# Altium schematic sheet 2016_BeaconIR_YahourtPhone.SchDoc
size A2
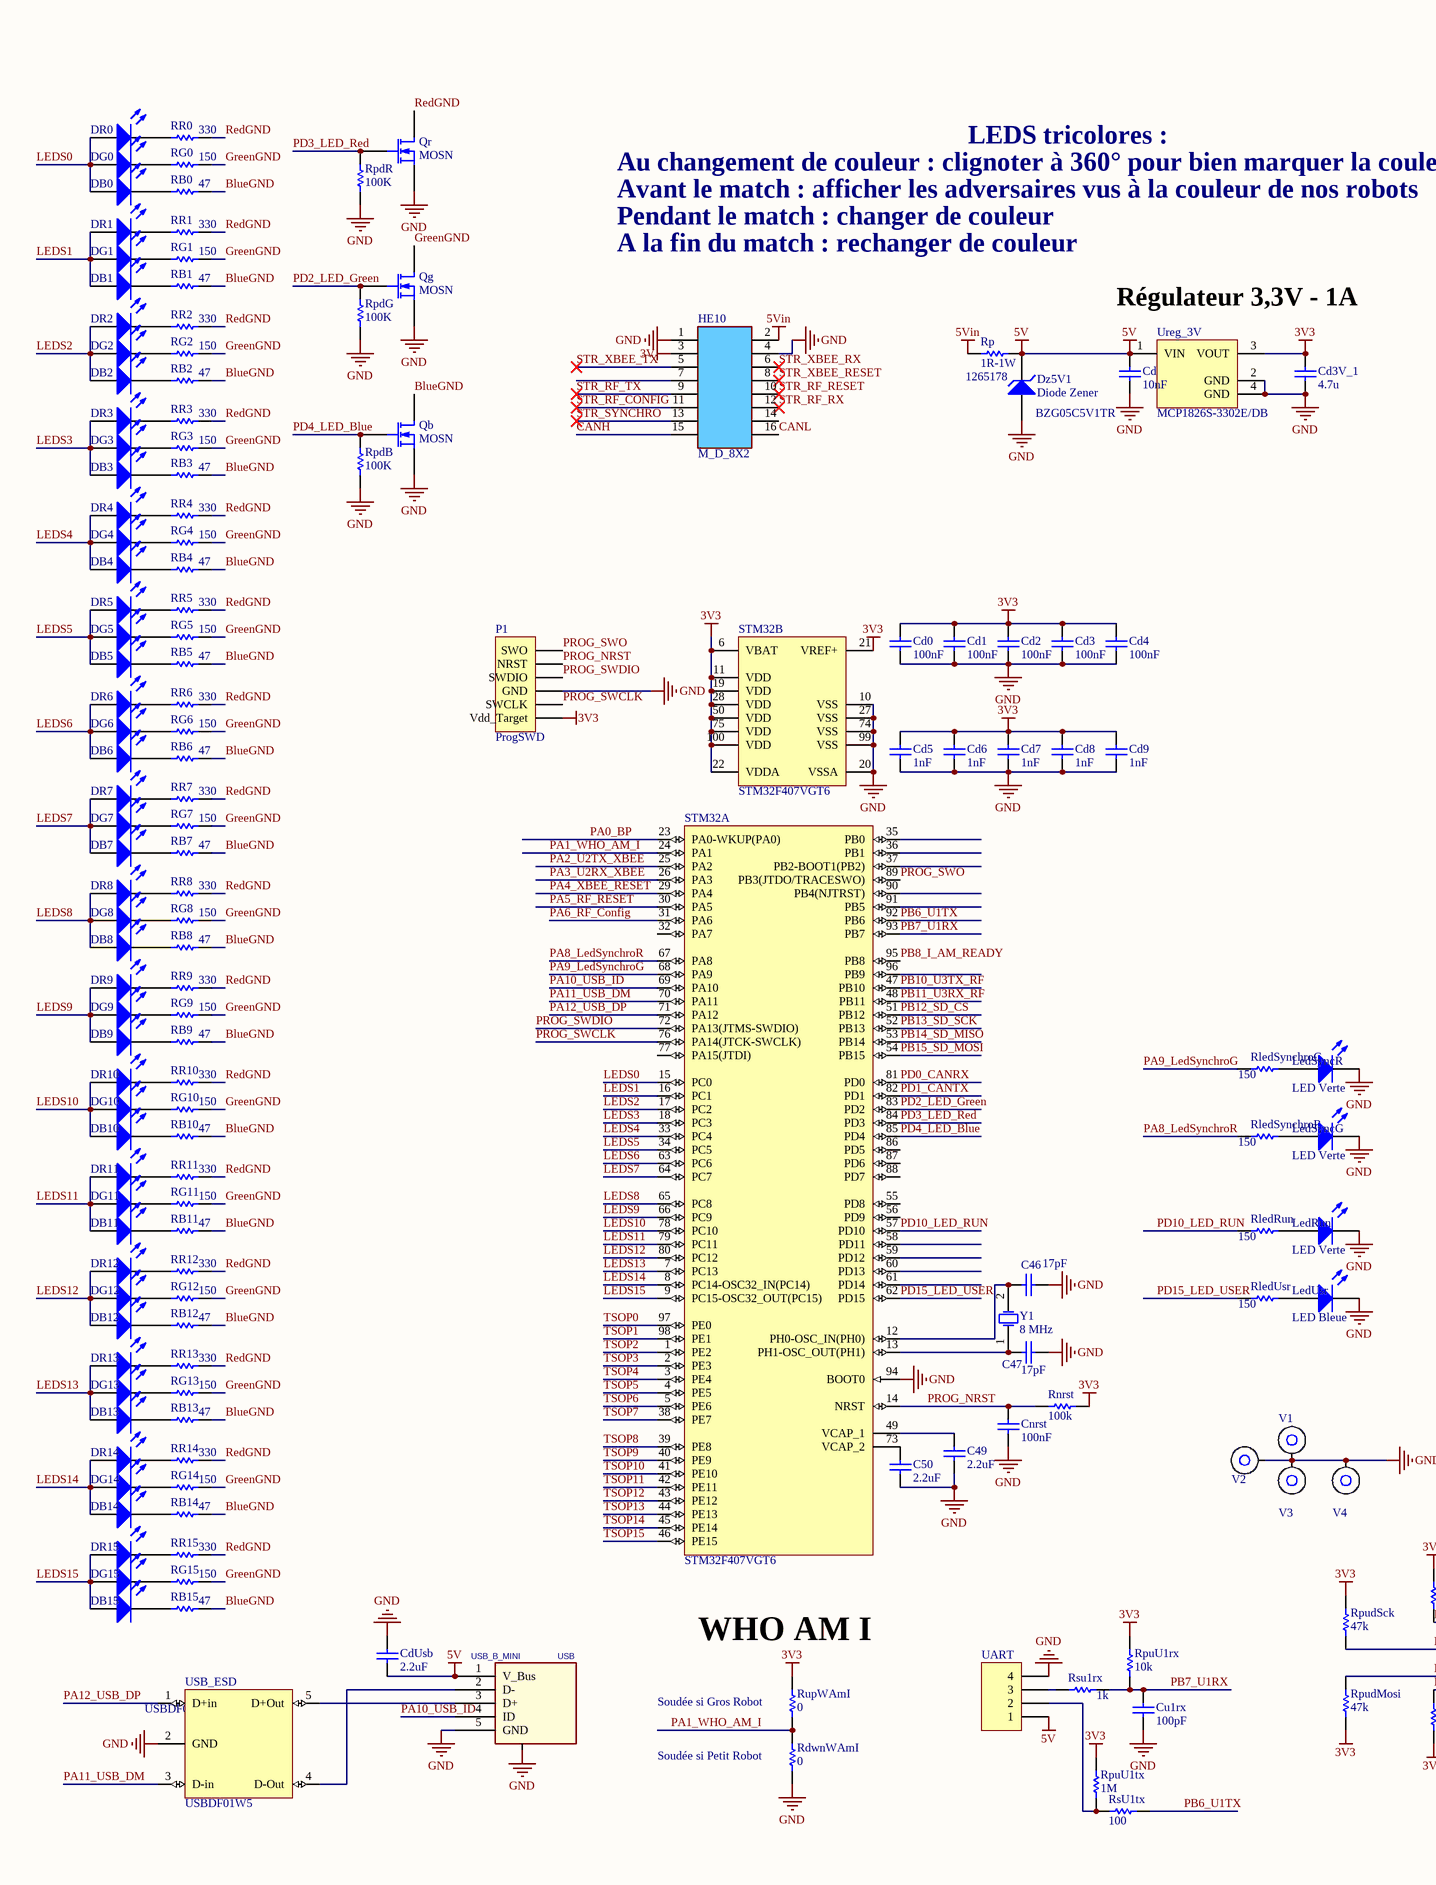
[diagram p0: 2016_BeaconIR_YahourtPhone.SchDoc, left]
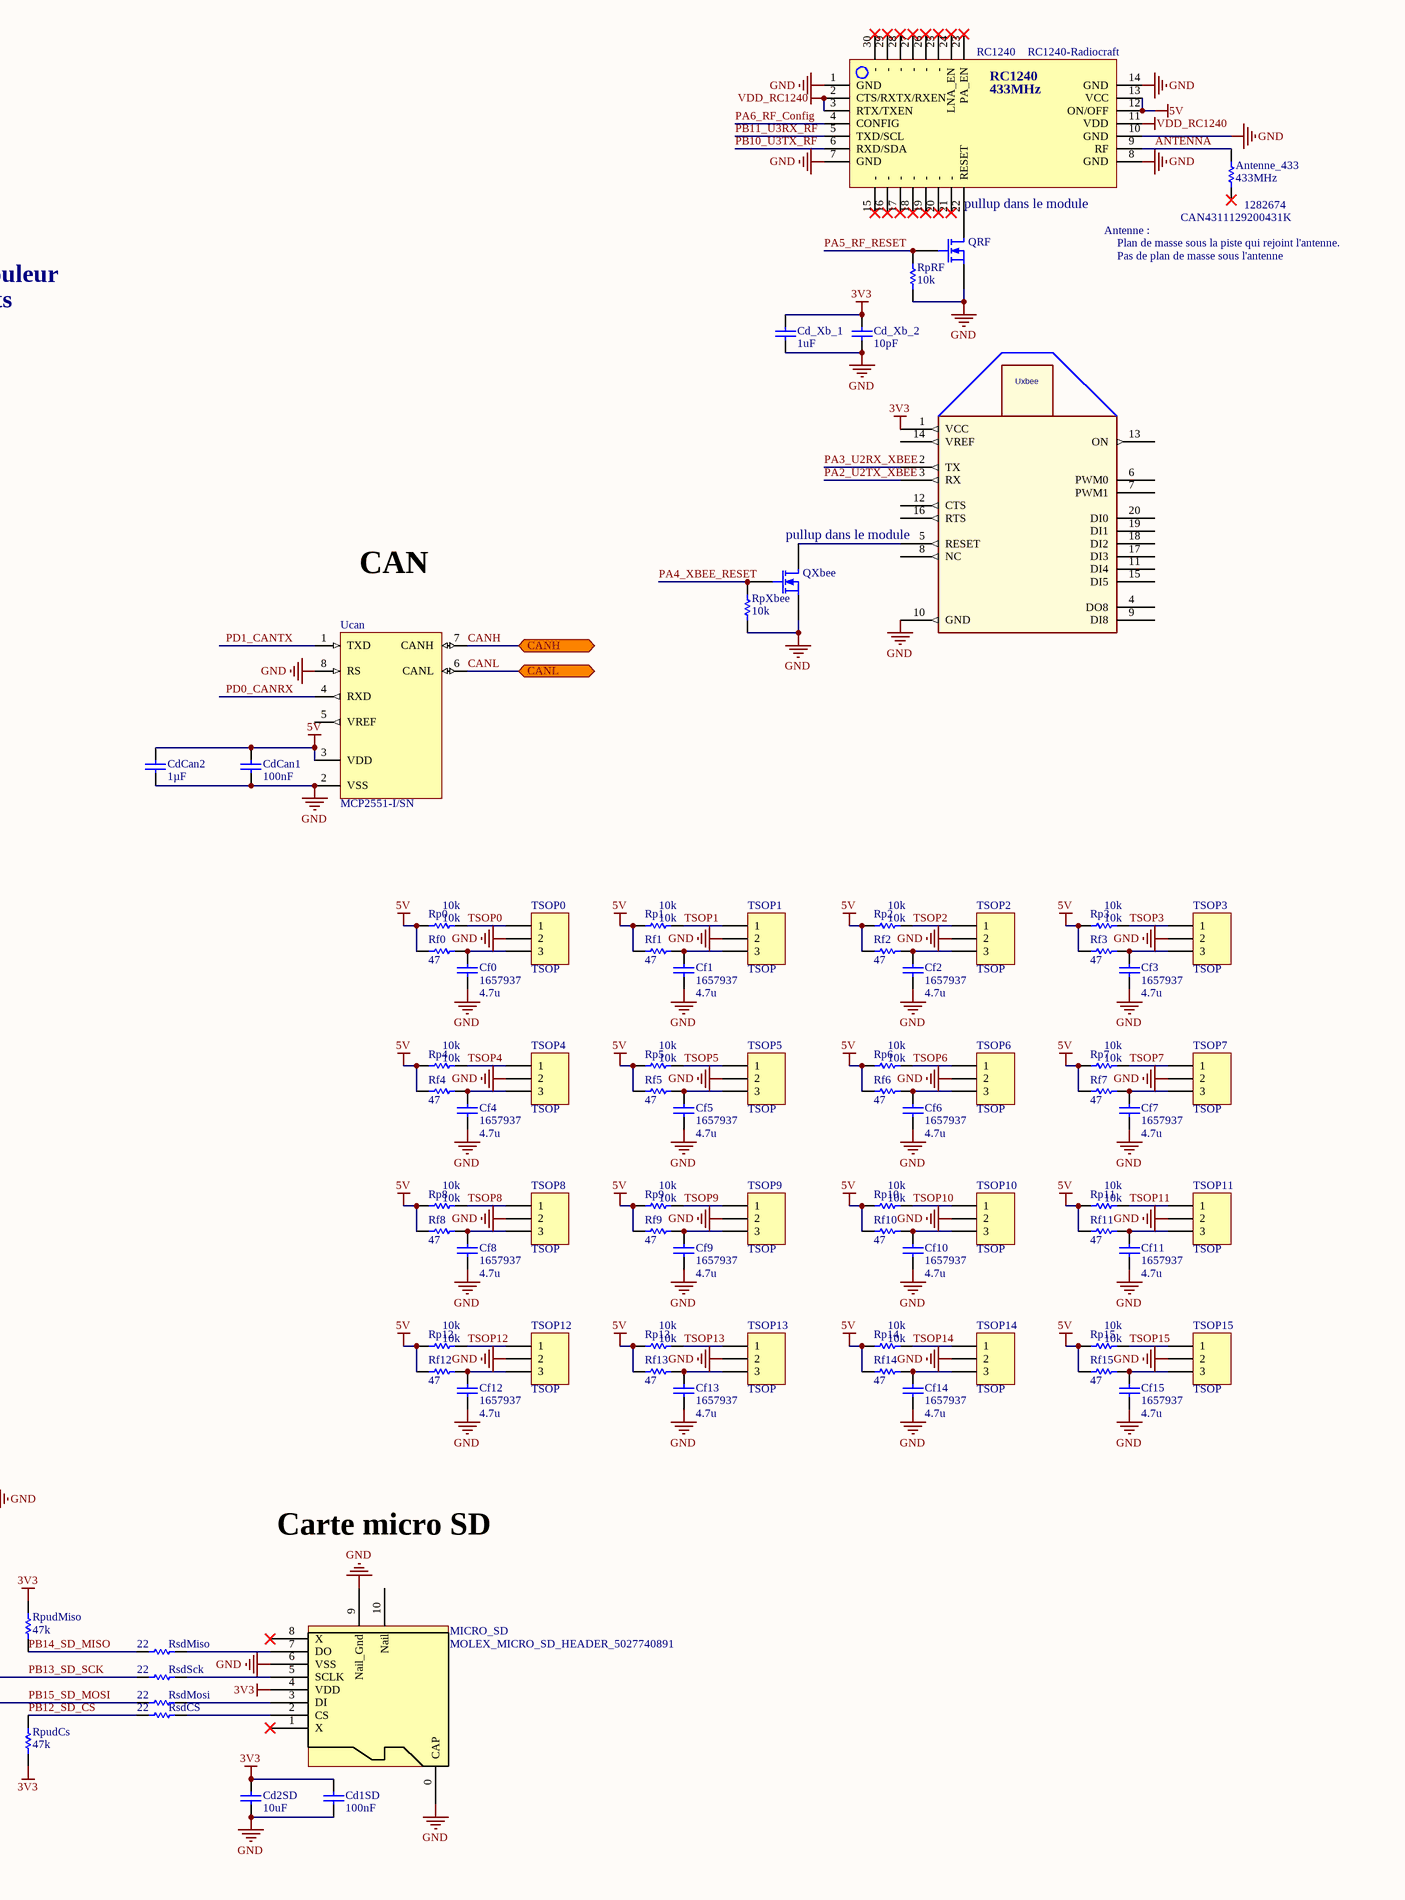
[diagram p1: 2016_BeaconIR_YahourtPhone.SchDoc, middle]
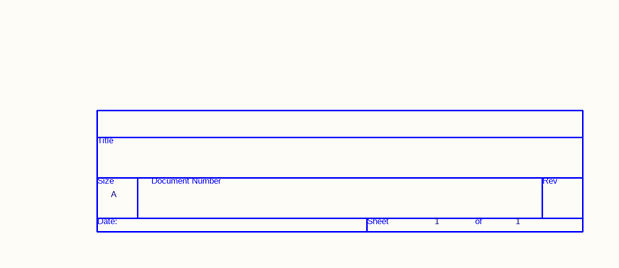
[diagram p2: 2016_BeaconIR_YahourtPhone.SchDoc, right]

## Parts
*  Page Count: 1  Page Size: A  (hidden comment: TitleBlock0)  (graphical)
Antenne_433  433MHz  FAR: 1282674  [R1206_N]
C46  17pF  [C0805_N]
C47  17pF  [C0805_N]
C49  2.2uF  [C0805_N]
C50  2.2uF  [C0805_N]
Cd  10nF  [C1206_N]
Cd0  100nF  [C0805_N]
Cd1  100nF  [C0805_N]
Cd1SD  100nF  [C0805_N]
Cd2  100nF  [C0805_N]
Cd2SD  10uF  [C1206_N]
Cd3  100nF  [C0805_N]
Cd3V_1  4.7u  [C0805_N]
Cd4  100nF  [C0805_N]
Cd5  1nF  [C0805_N]
Cd6  1nF  [C0805_N]
Cd7  1nF  [C0805_N]
Cd8  1nF  [C0805_N]
Cd9  1nF  [C0805_N]
Cd_Xb_1  1uF  [C0805_N]
Cd_Xb_2  10pF  [C0805_N]
CdCan1  100nF  [C0805_N]
CdCan2  1µF  [C0805_N]
CdUsb  2.2uF  [C0805_N]
Cf0  1657937  value 4.7u  [C1206_N]
Cf1  1657937  value 4.7u  [C1206_N]
Cf2  1657937  value 4.7u  [C1206_N]
Cf3  1657937  value 4.7u  [C1206_N]
Cf4  1657937  value 4.7u  [C1206_N]
Cf5  1657937  value 4.7u  [C1206_N]
Cf6  1657937  value 4.7u  [C1206_N]
Cf7  1657937  value 4.7u  [C1206_N]
Cf8  1657937  value 4.7u  [C1206_N]
Cf9  1657937  value 4.7u  [C1206_N]
Cf10  1657937  value 4.7u  [C1206_N]
Cf11  1657937  value 4.7u  [C1206_N]
Cf12  1657937  value 4.7u  [C1206_N]
Cf13  1657937  value 4.7u  [C1206_N]
Cf14  1657937  value 4.7u  [C1206_N]
Cf15  1657937  value 4.7u  [C1206_N]
Cnrst  100nF  [C0805_N]
Cu1rx  100pF  [C0805_N]
DB0  LED  [LED_sideView_1204]  (value not drawn)
DB1  LED  [LED_sideView_1204]  (value not drawn)
DB2  LED  [LED_sideView_1204]  (value not drawn)
DB3  LED  [LED_sideView_1204]  (value not drawn)
DB4  LED  [LED_sideView_1204]  (value not drawn)
DB5  LED  [LED_sideView_1204]  (value not drawn)
DB6  LED  [LED_sideView_1204]  (value not drawn)
DB7  LED  [LED_sideView_1204]  (value not drawn)
DB8  LED  [LED_sideView_1204]  (value not drawn)
DB9  LED  [LED_sideView_1204]  (value not drawn)
DB10  LED  [LED_sideView_1204]  (value not drawn)
DB11  LED  [LED_sideView_1204]  (value not drawn)
DB12  LED  [LED_sideView_1204]  (value not drawn)
DB13  LED  [LED_sideView_1204]  (value not drawn)
DB14  LED  [LED_sideView_1204]  (value not drawn)
DB15  LED  [LED_sideView_1204]  (value not drawn)
DG0  LED  [LED_sideView_1204]  (value not drawn)
DG1  LED  [LED_sideView_1204]  (value not drawn)
DG2  LED  [LED_sideView_1204]  (value not drawn)
DG3  LED  [LED_sideView_1204]  (value not drawn)
DG4  LED  [LED_sideView_1204]  (value not drawn)
DG5  LED  [LED_sideView_1204]  (value not drawn)
DG6  LED  [LED_sideView_1204]  (value not drawn)
DG7  LED  [LED_sideView_1204]  (value not drawn)
DG8  LED  [LED_sideView_1204]  (value not drawn)
DG9  LED  [LED_sideView_1204]  (value not drawn)
DG10  LED  [LED_sideView_1204]  (value not drawn)
DG11  LED  [LED_sideView_1204]  (value not drawn)
DG12  LED  [LED_sideView_1204]  (value not drawn)
DG13  LED  [LED_sideView_1204]  (value not drawn)
DG14  LED  [LED_sideView_1204]  (value not drawn)
DG15  LED  [LED_sideView_1204]  (value not drawn)
DR0  LED  [LED_sideView_1204]  (value not drawn)
DR1  LED  [LED_sideView_1204]  (value not drawn)
DR2  LED  [LED_sideView_1204]  (value not drawn)
DR3  LED  [LED_sideView_1204]  (value not drawn)
DR4  LED  [LED_sideView_1204]  (value not drawn)
DR5  LED  [LED_sideView_1204]  (value not drawn)
DR6  LED  [LED_sideView_1204]  (value not drawn)
DR7  LED  [LED_sideView_1204]  (value not drawn)
DR8  LED  [LED_sideView_1204]  (value not drawn)
DR9  LED  [LED_sideView_1204]  (value not drawn)
DR10  LED  [LED_sideView_1204]  (value not drawn)
DR11  LED  [LED_sideView_1204]  (value not drawn)
DR12  LED  [LED_sideView_1204]  (value not drawn)
DR13  LED  [LED_sideView_1204]  (value not drawn)
DR14  LED  [LED_sideView_1204]  (value not drawn)
DR15  LED  [LED_sideView_1204]  (value not drawn)
Dz5V1  Diode Zener  [SMA Diode]
HE10  Type: M_D_8X2  [HE10/16_M_D_B P]  (hidden comment: BARRETTE_8 CONTACTS_2 RANGEES_MALE_DROITE)
LedRun  LED Verte  [LED_0805]
LedSyncG  LED Verte  [LED_0805]
LedSyncR  LED Verte  [LED_0805]
LedUsr  LED Bleue  [LED_0805]
MICRO_SD  MOLEX_MICRO_SD_HEADER_5027740891  [MOLEX_MICRO_SD_HEADER_5027740891]
P1  ProgSWD  [HDR1X6]
Qb  MOSN  [SOT23-3N]
Qg  MOSN  [SOT23-3N]
Qr  MOSN  [SOT23-3N]
QRF  Transistor MOSFET-N  [SOT23-3N]  (value not drawn)
QXbee  Transistor MOSFET-N  [SOT23-3N]  (value not drawn)
RB0  47  [R1206_N]
RB1  47  [R1206_N]
RB2  47  [R1206_N]
RB3  47  [R1206_N]
RB4  47  [R1206_N]
RB5  47  [R1206_N]
RB6  47  [R1206_N]
RB7  47  [R1206_N]
RB8  47  [R1206_N]
RB9  47  [R1206_N]
RB10  47  [R1206_N]
RB11  47  [R1206_N]
RB12  47  [R1206_N]
RB13  47  [R1206_N]
RB14  47  [R1206_N]
RB15  47  [R1206_N]
RC1240  RC1240-Radiocraft  [RC1240]
RdwnWAmI  0  [R1206_N]
Rf0  47  [R1206_N]
Rf1  47  [R1206_N]
Rf2  47  [R1206_N]
Rf3  47  [R1206_N]
Rf4  47  [R1206_N]
Rf5  47  [R1206_N]
Rf6  47  [R1206_N]
Rf7  47  [R1206_N]
Rf8  47  [R1206_N]
Rf9  47  [R1206_N]
Rf10  47  [R1206_N]
Rf11  47  [R1206_N]
Rf12  47  [R1206_N]
Rf13  47  [R1206_N]
Rf14  47  [R1206_N]
Rf15  47  [R1206_N]
RG0  150  [R1206_N]
RG1  150  [R1206_N]
RG2  150  [R1206_N]
RG3  150  [R1206_N]
RG4  150  [R1206_N]
RG5  150  [R1206_N]
RG6  150  [R1206_N]
RG7  150  [R1206_N]
RG8  150  [R1206_N]
RG9  150  [R1206_N]
RG10  150  [R1206_N]
RG11  150  [R1206_N]
RG12  150  [R1206_N]
RG13  150  [R1206_N]
RG14  150  [R1206_N]
RG15  150  [R1206_N]
RledRun  150  [R1206_N]
RledSynchroG  150  [R1206_N]
RledSynchroR  150  [R1206_N]
RledUsr  150  [R1206_N]
Rnrst  100k  [R1206_N]
Rp  1R-1W  FAR: 1265178  [INDUCTANCE_CMS_1812]
Rp0  10k  [R1206_N]
Rp1  10k  [R1206_N]
Rp2  10k  [R1206_N]
Rp3  10k  [R1206_N]
Rp4  10k  [R1206_N]
Rp5  10k  [R1206_N]
Rp6  10k  [R1206_N]
Rp7  10k  [R1206_N]
Rp8  10k  [R1206_N]
Rp9  10k  [R1206_N]
Rp10  10k  [R1206_N]
Rp11  10k  [R1206_N]
Rp12  10k  [R1206_N]
Rp13  10k  [R1206_N]
Rp14  10k  [R1206_N]
Rp15  10k  [R1206_N]
RpdB  100K  [R1206_N]
RpdG  100K  [R1206_N]
RpdR  100K  [R1206_N]
RpRF  10k  [R1206_N]
RpudCs  47k  [R1206_N]
RpudMiso  47k  [R1206_N]
RpudMosi  47k  [R1206_N]
RpudSck  47k  [R1206_N]
RpuU1rx  10k  [R1206_N]
RpuU1tx  1M  [R1206_N]
RpXbee  10k  [R1206_N]
RR0  330  [R1206_N]
RR1  330  [R1206_N]
RR2  330  [R1206_N]
RR3  330  [R1206_N]
RR4  330  [R1206_N]
RR5  330  [R1206_N]
RR6  330  [R1206_N]
RR7  330  [R1206_N]
RR8  330  [R1206_N]
RR9  330  [R1206_N]
RR10  330  [R1206_N]
RR11  330  [R1206_N]
RR12  330  [R1206_N]
RR13  330  [R1206_N]
RR14  330  [R1206_N]
RR15  330  [R1206_N]
RsdCS  22  [R1206_N]
RsdMiso  22  [R1206_N]
RsdMosi  22  [R1206_N]
RsdSck  22  [R1206_N]
Rsu1rx  1k  [R1206_N]
RsU1tx  100  [R1206_N]
RupWAmI  0  [R1206_N]
STM32  STM32F407VGT6  [STM-LQFP100_N]  (parts A,B of 2)
TSOP0  TSOP  [HDR1X3]
TSOP1  TSOP  [HDR1X3]
TSOP2  TSOP  [HDR1X3]
TSOP3  TSOP  [HDR1X3]
TSOP4  TSOP  [HDR1X3]
TSOP5  TSOP  [HDR1X3]
TSOP6  TSOP  [HDR1X3]
TSOP7  TSOP  [HDR1X3]
TSOP8  TSOP  [HDR1X3]
TSOP9  TSOP  [HDR1X3]
TSOP10  TSOP  [HDR1X3]
TSOP11  TSOP  [HDR1X3]
TSOP12  TSOP  [HDR1X3]
TSOP13  TSOP  [HDR1X3]
TSOP14  TSOP  [HDR1X3]
TSOP15  TSOP  [HDR1X3]
UART  BARRETTE4  [HDR1X4]  (value not drawn)
Ucan  MCP2551-I/SN  [SO8_N]
Ureg_3V  MCP1826S-3302E/DB  [SOT223-4N]
USB  USB_B_MINI  [USB_MICROAB_VERTICAL]
USB_ESD  USBDF01W5  [SOT353_N]
Uxbee  XBee  [MODULE_XBEE]  (value not drawn)
V1  Entretoise WURTH CMS  [ENTRETOISE_CMS]  (value not drawn)
V2  Entretoise WURTH CMS  [ENTRETOISE_CMS]  (value not drawn)
V3  Entretoise WURTH CMS  [ENTRETOISE_CMS]  (value not drawn)
V4  Entretoise WURTH CMS  [ENTRETOISE_CMS]  (value not drawn)
Y1  8 MHz  [HC49/4H_SMX]

## Ports
CANH (bidir), CANL (bidir)

## Nets
3V: HE10.3
3V3: Cd0.2 Cd1.2 Cd1SD.2 Cd2.2 Cd2SD.2 Cd3.2 Cd3V_1.2 Cd4.2 Cd5.2 Cd6.2 Cd7.2 Cd8.2 Cd9.2 Cd_Xb_1.2 Cd_Xb_2.2 MICRO_SD.4(VDD) P1.1(Vdd_Target) Rnrst.2 RpudCs.1 RpudMiso.2 RpudMosi.1 RpudSck.2 RpuU1rx.2 RpuU1tx.2 RupWAmI.2 STM32.6(VBAT) STM32.11(VDD) STM32.19(VDD) STM32.21(VREF+) STM32.22(VDDA) STM32.28(VDD) STM32.50(VDD) STM32.75(VDD) STM32.100(VDD) Ureg_3V.3(VOUT) Uxbee.1(VCC)
5V: Cd.2 CdCan1.2 CdCan2.2 CdUsb.1 Dz5V1.2(K) RC1240.12(ON/OFF) RC1240.13(VCC) Rf0.1 Rf1.1 Rf2.1 Rf3.1 Rf4.1 Rf5.1 Rf6.1 Rf7.1 Rf8.1 Rf9.1 Rf10.1 Rf11.1 Rf12.1 Rf13.1 Rf14.1 Rf15.1 Rp.2 Rp0.1 Rp1.1 Rp2.1 Rp3.1 Rp4.1 Rp5.1 Rp6.1 Rp7.1 Rp8.1 Rp9.1 Rp10.1 Rp11.1 Rp12.1 Rp13.1 Rp14.1 Rp15.1 UART.1 Ucan.3(VDD) Ureg_3V.1(VIN) USB.1(V_Bus)
5Vin: HE10.2 Rp.1
GND: C46.1 C47.1 C49.1 C50.1 Cd.1 Cd0.1 Cd1.1 Cd1SD.1 Cd2.1 Cd2SD.1 Cd3.1 Cd3V_1.1 Cd4.1 Cd5.1 Cd6.1 Cd7.1 Cd8.1 Cd9.1 Cd_Xb_1.1 Cd_Xb_2.1 CdCan1.1 CdCan2.1 CdUsb.2 Cf0.1 Cf1.1 Cf2.1 Cf3.1 Cf4.1 Cf5.1 Cf6.1 Cf7.1 Cf8.1 Cf9.1 Cf10.1 Cf11.1 Cf12.1 Cf13.1 Cf14.1 Cf15.1 Cnrst.1 Cu1rx.1 Dz5V1.1(A) HE10.1 HE10.4 LedRun.2(K) LedSyncG.2(K) LedSyncR.2(K) LedUsr.2(K) MICRO_SD.0(CAP) MICRO_SD.6(VSS) MICRO_SD.9(Nail_Gnd) P1.3(GND) Qb.2(S) Qg.2(S) Qr.2(S) QRF.2(S) QXbee.2(S) RC1240.1(GND) RC1240.7(GND) RC1240.8(GND) RC1240.10(GND) RC1240.14(GND) RdwnWAmI.1 RpdB.1 RpdG.1 RpdR.1 RpRF.2 RpXbee.2 STM32.10(VSS) STM32.20(VSSA) STM32.27(VSS) STM32.74(VSS) STM32.94(BOOT0) STM32.99(VSS) TSOP0.2 TSOP1.2 TSOP2.2 TSOP3.2 TSOP4.2 TSOP5.2 TSOP6.2 TSOP7.2 TSOP8.2 TSOP9.2 TSOP10.2 TSOP11.2 TSOP12.2 TSOP13.2 TSOP14.2 TSOP15.2 UART.4 Ucan.2(VSS) Ucan.8(RS) Ureg_3V.2(GND) Ureg_3V.4(GND) USB.5(GND) USB.6(Blindage) USB_ESD.2(GND) Uxbee.10(GND) V1.1 V2.1 V3.1 V4.1
VDD_RC1240: RC1240.2(CTS/RXTX/RXEN) RC1240.3(RTX/TXEN) RC1240.11(VDD)
ANTENNA: Antenne_433.1 RC1240.9(RF)
BlueGND: Qb.3(D) RB0.1 RB1.1 RB2.1 RB3.1 RB4.1 RB5.1 RB6.1 RB7.1 RB8.1 RB9.1 RB10.1 RB11.1 RB12.1 RB13.1 RB14.1 RB15.1
CANH: HE10.15 Ucan.7(CANH) ; port CANH
CANL: HE10.16 Ucan.6(CANL) ; port CANL
GreenGND: Qg.3(D) RG0.1 RG1.1 RG2.1 RG3.1 RG4.1 RG5.1 RG6.1 RG7.1 RG8.1 RG9.1 RG10.1 RG11.1 RG12.1 RG13.1 RG14.1 RG15.1
LEDS0: DB0.1(A) DG0.1(A) DR0.1(A) STM32.15(PC0)
LEDS1: DB1.1(A) DG1.1(A) DR1.1(A) STM32.16(PC1)
LEDS2: DB2.1(A) DG2.1(A) DR2.1(A) STM32.17(PC2)
LEDS3: DB3.1(A) DG3.1(A) DR3.1(A) STM32.18(PC3)
LEDS4: DB4.1(A) DG4.1(A) DR4.1(A) STM32.33(PC4)
LEDS5: DB5.1(A) DG5.1(A) DR5.1(A) STM32.34(PC5)
LEDS6: DB6.1(A) DG6.1(A) DR6.1(A) STM32.63(PC6)
LEDS7: DB7.1(A) DG7.1(A) DR7.1(A) STM32.64(PC7)
LEDS8: DB8.1(A) DG8.1(A) DR8.1(A) STM32.65(PC8)
LEDS9: DB9.1(A) DG9.1(A) DR9.1(A) STM32.66(PC9)
LEDS10: DB10.1(A) DG10.1(A) DR10.1(A) STM32.78(PC10)
LEDS11: DB11.1(A) DG11.1(A) DR11.1(A) STM32.79(PC11)
LEDS12: DB12.1(A) DG12.1(A) DR12.1(A) STM32.80(PC12)
LEDS13: DB13.1(A) DG13.1(A) DR13.1(A) STM32.7(PC13)
LEDS14: DB14.1(A) DG14.1(A) DR14.1(A) STM32.8(PC14-OSC32_IN(PC14))
LEDS15: DB15.1(A) DG15.1(A) DR15.1(A) STM32.9(PC15-OSC32_OUT(PC15))
PA0_BP: STM32.23(PA0-WKUP(PA0))
PA1_WHO_AM_I: RdwnWAmI.2 RupWAmI.1 STM32.24(PA1)
PA2_U2TX_XBEE: STM32.25(PA2) Uxbee.3(RX)
PA3_U2RX_XBEE: STM32.26(PA3) Uxbee.2(TX)
PA4_XBEE_RESET: QXbee.1(G) RpXbee.1 STM32.29(PA4)
PA5_RF_RESET: QRF.1(G) RpRF.1 STM32.30(PA5)
PA6_RF_Config: RC1240.4(CONFIG) STM32.31(PA6)
PA8_LedSynchroR: RledSynchroR.2 STM32.67(PA8)
PA9_LedSynchroG: RledSynchroG.2 STM32.68(PA9)
PA10_USB_ID: STM32.69(PA10) USB.4(ID)
PA11_USB_DM: STM32.70(PA11) USB_ESD.3(D-in)
PA12_USB_DP: STM32.71(PA12) USB_ESD.1(D+in)
PB6_U1TX: RsU1tx.2 STM32.92(PB6)
PB7_U1RX: Cu1rx.2 RpuU1rx.1 Rsu1rx.1 STM32.93(PB7)
PB8_I_AM_READY: STM32.95(PB8)
PB10_U3TX_RF: RC1240.6(RXD/SDA) STM32.47(PB10)
PB11_U3RX_RF: RC1240.5(TXD/SCL) STM32.48(PB11)
PB12_SD_CS: RpudCs.2 RsdCS.1 STM32.51(PB12)
PB13_SD_SCK: RpudSck.1 RsdSck.1 STM32.52(PB13)
PB14_SD_MISO: RpudMiso.1 RsdMiso.1 STM32.53(PB14)
PB15_SD_MOSI: RpudMosi.2 RsdMosi.1 STM32.54(PB15)
PD0_CANRX: STM32.81(PD0) Ucan.4(RXD)
PD1_CANTX: STM32.82(PD1) Ucan.1(TXD)
PD2_LED_Green: Qg.1(G) RpdG.2 STM32.83(PD2)
PD3_LED_Red: Qr.1(G) RpdR.2 STM32.84(PD3)
PD4_LED_Blue: Qb.1(G) RpdB.2 STM32.85(PD4)
PD10_LED_RUN: RledRun.2 STM32.57(PD10)
PD15_LED_USER: RledUsr.2 STM32.62(PD15)
PROG_NRST: Cnrst.2 P1.5(NRST) Rnrst.1 STM32.14(NRST)
PROG_SWCLK: P1.2(SWCLK) STM32.76(PA14(JTCK-SWCLK))
PROG_SWDIO: P1.4(SWDIO) STM32.72(PA13(JTMS-SWDIO))
PROG_SWO: P1.6(SWO) STM32.89(PB3(JTDO/TRACESWO))
RedGND: Qr.3(D) RR0.1 RR1.1 RR2.1 RR3.1 RR4.1 RR5.1 RR6.1 RR7.1 RR8.1 RR9.1 RR10.1 RR11.1 RR12.1 RR13.1 RR14.1 RR15.1
STR_RF_CONFIG: HE10.11
STR_RF_RESET: HE10.10
STR_RF_RX: HE10.12
STR_RF_TX: HE10.9
STR_SYNCHRO: HE10.13
STR_XBEE_RESET: HE10.8
STR_XBEE_RX: HE10.6
STR_XBEE_TX: HE10.5
TSOP0: Rp0.2 STM32.97(PE0) TSOP0.1
TSOP1: Rp1.2 STM32.98(PE1) TSOP1.1
TSOP2: Rp2.2 STM32.1(PE2) TSOP2.1
TSOP3: Rp3.2 STM32.2(PE3) TSOP3.1
TSOP4: Rp4.2 STM32.3(PE4) TSOP4.1
TSOP5: Rp5.2 STM32.4(PE5) TSOP5.1
TSOP6: Rp6.2 STM32.5(PE6) TSOP6.1
TSOP7: Rp7.2 STM32.38(PE7) TSOP7.1
TSOP8: Rp8.2 STM32.39(PE8) TSOP8.1
TSOP9: Rp9.2 STM32.40(PE9) TSOP9.1
TSOP10: Rp10.2 STM32.41(PE10) TSOP10.1
TSOP11: Rp11.2 STM32.42(PE11) TSOP11.1
TSOP12: Rp12.2 STM32.43(PE12) TSOP12.1
TSOP13: Rp13.2 STM32.44(PE13) TSOP13.1
TSOP14: Rp14.2 STM32.45(PE14) TSOP14.1
TSOP15: Rp15.2 STM32.46(PE15) TSOP15.1
NetC46_2: C46.2 STM32.12(PH0-OSC_IN(PH0)) Y1.2(OSC2)
NetC47_2: C47.2 STM32.13(PH1-OSC_OUT(PH1)) Y1.1(OSC1)
NetC49_2: C49.2 STM32.49(VCAP_1)
NetC50_2: C50.2 STM32.73(VCAP_2)
NetCf0_2: Cf0.2 Rf0.2 TSOP0.3
NetCf1_2: Cf1.2 Rf1.2 TSOP1.3
NetCf2_2: Cf2.2 Rf2.2 TSOP2.3
NetCf3_2: Cf3.2 Rf3.2 TSOP3.3
NetCf4_2: Cf4.2 Rf4.2 TSOP4.3
NetCf5_2: Cf5.2 Rf5.2 TSOP5.3
NetCf6_2: Cf6.2 Rf6.2 TSOP6.3
NetCf7_2: Cf7.2 Rf7.2 TSOP7.3
NetCf8_2: Cf8.2 Rf8.2 TSOP8.3
NetCf9_2: Cf9.2 Rf9.2 TSOP9.3
NetCf10_2: Cf10.2 Rf10.2 TSOP10.3
NetCf11_2: Cf11.2 Rf11.2 TSOP11.3
NetCf12_2: Cf12.2 Rf12.2 TSOP12.3
NetCf13_2: Cf13.2 Rf13.2 TSOP13.3
NetCf14_2: Cf14.2 Rf14.2 TSOP14.3
NetCf15_2: Cf15.2 Rf15.2 TSOP15.3
NetDB0_2: DB0.2(K) RB0.2
NetDB1_2: DB1.2(K) RB1.2
NetDB2_2: DB2.2(K) RB2.2
NetDB3_2: DB3.2(K) RB3.2
NetDB4_2: DB4.2(K) RB4.2
NetDB5_2: DB5.2(K) RB5.2
NetDB6_2: DB6.2(K) RB6.2
NetDB7_2: DB7.2(K) RB7.2
NetDB8_2: DB8.2(K) RB8.2
NetDB9_2: DB9.2(K) RB9.2
NetDB10_2: DB10.2(K) RB10.2
NetDB11_2: DB11.2(K) RB11.2
NetDB12_2: DB12.2(K) RB12.2
NetDB13_2: DB13.2(K) RB13.2
NetDB14_2: DB14.2(K) RB14.2
NetDB15_2: DB15.2(K) RB15.2
NetDG0_2: DG0.2(K) RG0.2
NetDG1_2: DG1.2(K) RG1.2
NetDG2_2: DG2.2(K) RG2.2
NetDG3_2: DG3.2(K) RG3.2
NetDG4_2: DG4.2(K) RG4.2
NetDG5_2: DG5.2(K) RG5.2
NetDG6_2: DG6.2(K) RG6.2
NetDG7_2: DG7.2(K) RG7.2
NetDG8_2: DG8.2(K) RG8.2
NetDG9_2: DG9.2(K) RG9.2
NetDG10_2: DG10.2(K) RG10.2
NetDG11_2: DG11.2(K) RG11.2
NetDG12_2: DG12.2(K) RG12.2
NetDG13_2: DG13.2(K) RG13.2
NetDG14_2: DG14.2(K) RG14.2
NetDG15_2: DG15.2(K) RG15.2
NetDR0_2: DR0.2(K) RR0.2
NetDR1_2: DR1.2(K) RR1.2
NetDR2_2: DR2.2(K) RR2.2
NetDR3_2: DR3.2(K) RR3.2
NetDR4_2: DR4.2(K) RR4.2
NetDR5_2: DR5.2(K) RR5.2
NetDR6_2: DR6.2(K) RR6.2
NetDR7_2: DR7.2(K) RR7.2
NetDR8_2: DR8.2(K) RR8.2
NetDR9_2: DR9.2(K) RR9.2
NetDR10_2: DR10.2(K) RR10.2
NetDR11_2: DR11.2(K) RR11.2
NetDR12_2: DR12.2(K) RR12.2
NetDR13_2: DR13.2(K) RR13.2
NetDR14_2: DR14.2(K) RR14.2
NetDR15_2: DR15.2(K) RR15.2
NetLedRun_1: LedRun.1(A) RledRun.1
NetLedSyncG_1: LedSyncG.1(A) RledSynchroR.1
NetLedSyncR_1: LedSyncR.1(A) RledSynchroG.1
NetLedUsr_1: LedUsr.1(A) RledUsr.1
NetMICRO_SD_2: MICRO_SD.2(CS) RsdCS.2
NetMICRO_SD_3: MICRO_SD.3(DI) RsdMosi.2
NetMICRO_SD_5: MICRO_SD.5(SCLK) RsdSck.2
NetMICRO_SD_7: MICRO_SD.7(DO) RsdMiso.2
NetQRF_3: QRF.3(D) RC1240.22(RESET)
NetQXbee_3: QXbee.3(D) Uxbee.5(RESET)
NetRpuU1tx_1: RpuU1tx.1 RsU1tx.1 UART.2
NetRsu1rx_2: Rsu1rx.2 UART.3
NetUSB_2: USB.2(D-) USB_ESD.4(D-Out)
NetUSB_3: USB.3(D+) USB_ESD.5(D+Out)

Not connected (* = marked no-connect by the designer): Antenne_433 2*; HE10 7 14; MICRO_SD 1(X)* 8(X)* 10(Nail); RC1240 15(-)* 16(-)* 17(-)* 18(-)* 19(-)* 20(-)* 21(-)* 23(PA_EN)* 24(LNA_EN)* 25(-)* 26(-)* 27(-)* 28(-)* 29(-)* 30(-)*; STM32 32(PA7) 35(PB0) 36(PB1) 37(PB2-BOOT1(PB2)) 55(PD8) 56(PD9) 58(PD11) 59(PD12) 60(PD13) 61(PD14) 77(PA15(JTDI)) 86(PD5) 87(PD6) 88(PD7) 90(PB4(NJTRST)) 91(PB5) 96(PB9); Ucan 5(VREF); Uxbee 4(DO8) 6(PWM0) 7(PWM1) 8(NC) 9(DI8) 11(DI4) 12(CTS) 13(ON) 14(VREF) 15(DI5) 16(RTS) 17(DI3) 18(DI2) 19(DI1) 20(DI0)

## Notes on the sheet
- (near RC1240) pullup dans le module
- (near RC1240) Antenne :
- Plan de masse sous la piste qui rejoint l'antenne.
- Avant le match : afficher les adversaires vus à la couleur de nos robots
- Au changement de couleur : clignoter à 360° pour bien marquer la couleur
- LEDS tricolores :
- Pas de plan de masse sous l'antenne
- Pendant le match : changer de couleur
- A la fin du match : rechanger de couleur
- Régulateur 3,3V - 1A
- (near Uxbee) pullup dans le module
- CAN
- Carte micro SD
- (near RupWAmI) WHO AM I
- (near USB_ESD) USBDF01W5
- (near RupWAmI) Soudée si Gros Robot
- (near RdwnWAmI) Soudée si Petit Robot
- Title
- Size:
- Date:
- File:
- A2
- Number:
- Time:
- Revision:
- Sheet
- of
- (in symbol Diode Zener) BZG05C5V1TR
- (in symbol RC1240-Radiocraft) 433MHz
- (in symbol TitleBlock0) Title; Size; Document Number; Rev; Date:; Sheet; of

## Library data of the parts
Antenne_433 = Resistor: CAN4311129200431K; Published: 8-Jun-2000; LatestRevisionDate: 17-Jul-2002; LatestRevisionNote: Re-released for DXP Platform.; PackageReference: CAN4311129200431K; Publisher: Altium Limited
C46 C47 C49 C50 Cd Cd0 Cd1 Cd1SD Cd2 Cd2SD Cd3-Cd9 Cd_Xb_1 Cd_Xb_2 CdCan1 CdCan2 CdUsb Cnrst Cu1rx = Condensateur: Capacitor; Published: 8-Jun-2000; LatestRevisionDate: 17-Jul-2002; LatestRevisionNote: Re-released for DXP Platform.; PackageReference: RAD-0.3; Publisher: Altium Limited
Cd3V_1 = Capacitor: Published: 8-Jun-2000; LatestRevisionDate: 17-Jul-2002; LatestRevisionNote: Re-released for DXP Platform.; PackageReference: RAD-0.3; Publisher: Altium Limited
Cf0-Cf15 = CONDENSATEUR: Capacitor; Published: 8-Jun-2000; LatestRevisionDate: 17-Jul-2002; LatestRevisionNote: Re-released for DXP Platform.; PackageReference: RAD-0.3; Publisher: Altium Limited
DB0-DB15 DG0-DG15 DR0-DR15 LedRun LedSyncG LedSyncR LedUsr = LED: Typical LED; Published: 8-Jun-2000; LatestRevisionDate: 08-Jul-2005; LatestRevisionNote: Mech Layer 1 removed.; PackageReference: LED-1; Publisher: Altium Limited
Dz5V1 = Diode Zener: Zener Diode
P1 = Header 6: Header, 6-Pin; LatestRevisionDate: 17-Jul-2002; LatestRevisionNote: Re-released for DXP Platform.; Publisher: Altium Limited
Qb Qg Qr QRF QXbee = Transistor MOSFET-N: N-Channel MOSFET; PackageDocument: 1995/1996; Published: 8-Jun-2000; LatestRevisionDate: 17-Jul-2002; LatestRevisionNote: Re-released for DXP Platform.; PackageReference: E3; Publisher: Altium Limited
RB0-RB15 RdwnWAmI RG0-RG15 RledRun RledSynchroG RledSynchroR RledUsr Rnrst Rp RpdB RpdG RpdR RpRF RpudCs RpudMiso RpudMosi RpudSck RpuU1rx RpuU1tx RpXbee RR0-RR15 RsdCS RsdMiso RsdMosi RsdSck Rsu1rx RsU1tx RupWAmI = Resistor: Published: 8-Jun-2000; LatestRevisionDate: 17-Jul-2002; LatestRevisionNote: Re-released for DXP Platform.; PackageReference: AXIAL-0.5; Publisher: Altium Limited
RC1240 = RC1240-Radiocraft: RC1240 - Radiocraft 433MHz Transceiver
Rf0-Rf15 Rp0-Rp15 = RESISTANCE: Resistor; Published: 8-Jun-2000; LatestRevisionDate: 17-Jul-2002; LatestRevisionNote: Re-released for DXP Platform.; PackageReference: AXIAL-0.3; Publisher: Altium Limited
  Rp0-Rp15: Value: 10k
STM32 = STM32F407VGT6: ARM Cortex-M4 32-bit MCU+FPU, 210 DMIPS, 1024 kB Flash, 192 kB Internal RAM, 82 I/Os, 100-pin LQFP, -40 to 85 degC, Tray; Manufacturer: STMicroelectronics; D/A Converter: 2x12-bit; FLASH Size (Prog) (kB): 1024; I/Os (High Current): 82; Internal RAM Size (kB): 192; Operating Frequency(F) (Processor speed) (MHz): 168; Supply Voltage(Vcc) max (V): 3.6; Supply Voltage(Vcc) min (V): 1.8; DatasheetVersion: Rev. 4; PackageVersion: Rev. 1, 06/2013; PackageReference: LQFP100; PackageDescription: 100-Pin Low Profile Quad Flat Package, 14 x 14 mm Body, 0.5 mm Pitch; Supplier 1: Digi-Key; Supplier Part Number 1: 497-11605-ND; Supplier 2: Farnell; Supplier Part Number 2: 2064368; Supplier 3: Newark; Supplier Part Number 3: 73T2333; Supplier 4: Mouser; Supplier Part Number 4: 511-STM32F407VGT6; Core: ARM Cortex-M4; Packing: Tray; Mounting Technology: Surface Mount; PartNumber: STM32F407VGT6; ComponentLink1Description: Manufacturer URL; ComponentLink1URL: http://www.st.com/web/en/home.html; ComponentLink2Description: Datasheet; ComponentLink2URL: http://www.st.com/st-web-ui/static/active/en/resource/technical/document/datasheet/DM00037051.pdf; ComponentLink3Description: Package Specification; ComponentLink3URL: http://www.st.com/st-web-ui/static/active/en/resource/technical/document/data_brief/DM00071938.pdf
TSOP0-TSOP15 = BARRETTE3: Header, 3-Pin; LatestRevisionDate: 17-Jul-2002; LatestRevisionNote: Re-released for DXP Platform.; Publisher: Altium Limited
UART = BARRETTE4: Header, 4-Pin; LatestRevisionDate: 17-Jul-2002; LatestRevisionNote: Re-released for DXP Platform.; Publisher: Altium Limited
Ucan = MCP2551-I/SN: High-Speed CAN Transceiver, 8-Pin SOIC, Industrial Temperature; Published: 25/11/09; DatasheetVersion: revE, Jan-2007; PackageVersion: revAW, Oct-2008; PackageReference: SOIC-SN8; Publisher: Damien Guitton; PackageDescription: 8-Lead Plastic Small Outline (SN) - Narrow, 3.90mm Body [SOIC]; Code_JEDEC: MS-012; Code_IPC: SOIC127P600-8; ComponentLink1Description: Manufacturer Link; ComponentLink1URL: http://www.microchip.com; ComponentLink2Description: Datasheet; ComponentLink2URL: http://ww1.microchip.com/downloads/en/DeviceDoc/21667E.pdf; ComponentLink3Description: Packaging Specification; ComponentLink3URL: http://ww1.microchip.com/downloads/en/PackagingSpec/00049AW.pdf
Ureg_3V = MCP1826S-3302E/DB: 1000 mA, Low Voltage, Low Quiescent Current LDO Regulator, 3-Pin SOT-223, Extended Temperature; FirstPublished: 29-Jan-2009; DatasheetVersion: revA, Aug-2007; PackageVersion: revBB, Aug-2009; PackageReference: SOT-223-DB3; Publisher: Altium Limited; PackageDescription: 3-Lead Plastic Small Outline Transistor (DB) [SOT-223]; Supplier 1: Digi-Key; Supplier Part Number 1: MCP1826S-3302E/DB-ND; Supplier 2: Farnell; Supplier Part Number 2: 1578424; Supplier 3: Newark; Supplier Part Number 3: 27M0037; ComponentLink1Description: Datasheet; ComponentLink1URL: http://ww1.microchip.com/downloads/en/DeviceDoc/22057a.pdf; ComponentLink2Description: Packaging Specification; ComponentLink2URL: http://www.microchip.com/stellent/groups/techpub_sg/documents/packagingspec/en012702.pdf; ComponentLink3Description: Microchip.com Home; ComponentLink3URL: http://www.microchip.com/
USB = USB_B_MINI: Connector; USB; Type B; miniature; Pin Spacing=0.8mm
USB_ESD = USBDF01W5: USB protection ESD
V1-V4 = Entretoise WURTH CMS: Entretoise Wurth; Publisher: Damien Guitton
Y1 = Quartz: Crystal Oscillator; Published: 8-Jun-2000; LatestRevisionDate: 17-Jul-2002; LatestRevisionNote: Re-released for DXP Platform.; PackageReference: R38; Publisher: Altium Limited
* = TitleBlock0: Page Number: 1; Page Create Date: March  8, 1995